# Altium schematic sheet DebuggerConnectors.SchDoc
size A4
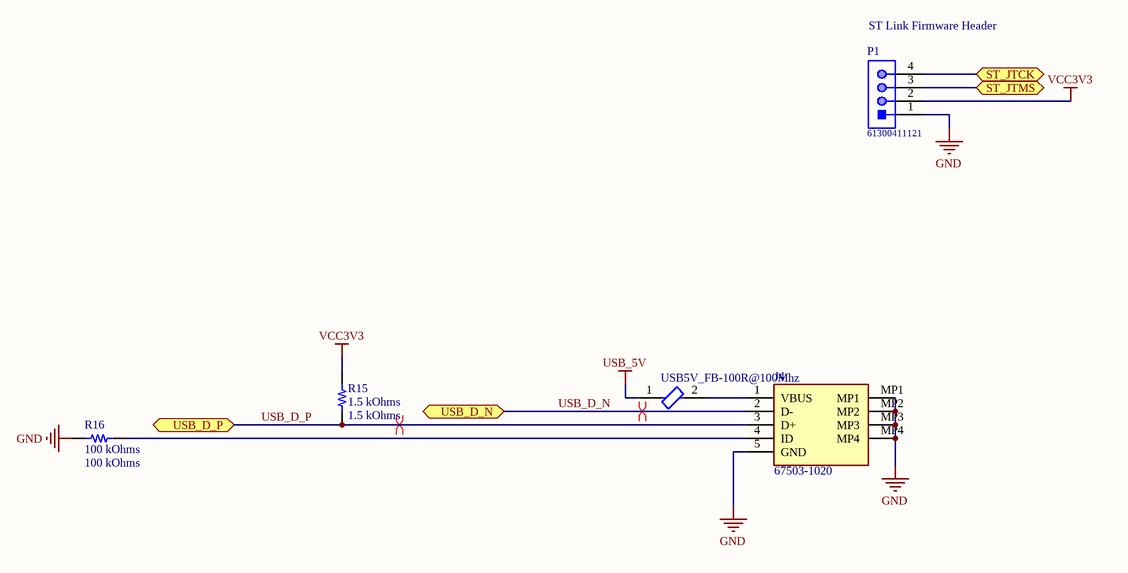
[diagram p0: DebuggerConnectors.SchDoc]

## Parts
J4  67503-1020  [675031020]
P1  61300411121  [61300411121]
R15  1.5 kOhms  [RES 0805_2012]
R16  100 kOhms  [RES 0805_2012]
USB5V_FB-100R@100Mhz  MPZ1608D101BTD25  [FP-MPZ1608-0_8-IPC_B]  (value not drawn)

## Ports
ST_JTCK (bidir), ST_JTMS (bidir), USB_D_N (bidir), USB_D_P (bidir)

## Nets
GND: J4.5(GND) J4.MP1 J4.MP2 J4.MP3 J4.MP4 P1.1 R16.1
USB_5V: USB5V_FB-100R@100Mhz.1
VCC3V3: P1.2 R15.2
ST_JTCK: P1.4 ; port ST_JTCK
ST_JTMS: P1.3 ; port ST_JTMS
USB_D_N: J4.2(D-) ; port USB_D_N
USB_D_P: J4.3(D+) R15.1 ; port USB_D_P
NetJ4_1: J4.1(VBUS) USB5V_FB-100R@100Mhz.2
NetJ4_4: J4.4(ID) R16.2

## Layout directives
differential pair: USB_D_N, USB_D_P

## Notes on the sheet
- (near P1) ST Link Firmware Header

## Library data of the parts
J4 = 67503-1020: USB Connectors USB Mini-B Recept On-The-Go Rt.Angle; Manufacturer_Name: Molex; Geometry.Height: 4.05mm; Manufacturer_Part_Number: 67503-1020; Mouser Part Number: 538-67503-1020; Mouser Price/Stock: https://www.mouser.co.uk/ProductDetail/Molex/67503-1020?qs=7zcQ9RRVJlhHWuXYKEhKMg%3D%3D; Arrow Part Number: *; Arrow Price/Stock: *; Datasheet Link: https://www.molex.com/pdm_docs/sd/675031020_sd.pdf
P1 = CMP-1502-01064-1: THT Vertical Pin Header WR-PHD, Pitch 2.54 mm, Single Row, 4 pins; Manufacturer: Wurth Elektronik; Withstanding Voltage: 500VAC; Rated Current: 3A; Working Voltage: 250VAC; Pin Number: 4; Gender: Male; Contact Resistance: 20mOhm; Pitch: 2.54mm; Manufacturer URL: http://www.we-online.de; Operating Temperature: -40to105degC; Packaging: Bag; Mounting Technology: THT; Package Reference: 61300411121; Datasheet URL: https://katalog.we-online.de/em/datasheet/6130xx11121.pdf; Publisher: WurthElektronik; Part Number: 61300411121; Row Number: Single; Orientation: Vertical
R15 = RNCF0805DTE1K50: RES 1.5K OHM 0.5% 1/8W 0805; Part Number: RNCF0805DTE1K50; Value: 1.5 kOhms
R16 = CPF0805B100KE: RES SMD 100K OHM 0.1% 1/10W 0805; Part Number: CPF0805B100KE; Value: 100 kOhms
USB5V_FB-100R@100Mhz = CMP-08257-000169-1: Power line Ferrite Bead 100Ω @ 100MHz 1A DCR 0.15Ω AEC-Q200 SMD 0603; Number of Lines: 1; Tolerance: 25%; Max DC Current: 2A; Impedance: 100R; DC Resistance (DCR): 150mR; Height: 0.037inch; Length: 0.063inch; Case Code (Imperial): 0603; Test Frequency: 100MHz; Termination: SMD/SMT; Weight: 7.1E-05oz; Max Current Rating: 1A; Case Code (Metric): 1608; Min Operating Temperature: -55°C; Mount: Surface Mount; Package Quantity: 4000; Width: 0.031inch; RoHS Compliant: Yes; Ratings: AEC-Q200; Case/Package: 0603; Max Operating Temperature: 125°C; Packaging: Tape and Reel